# EAGLE design control (EAGLE 7.7.0)
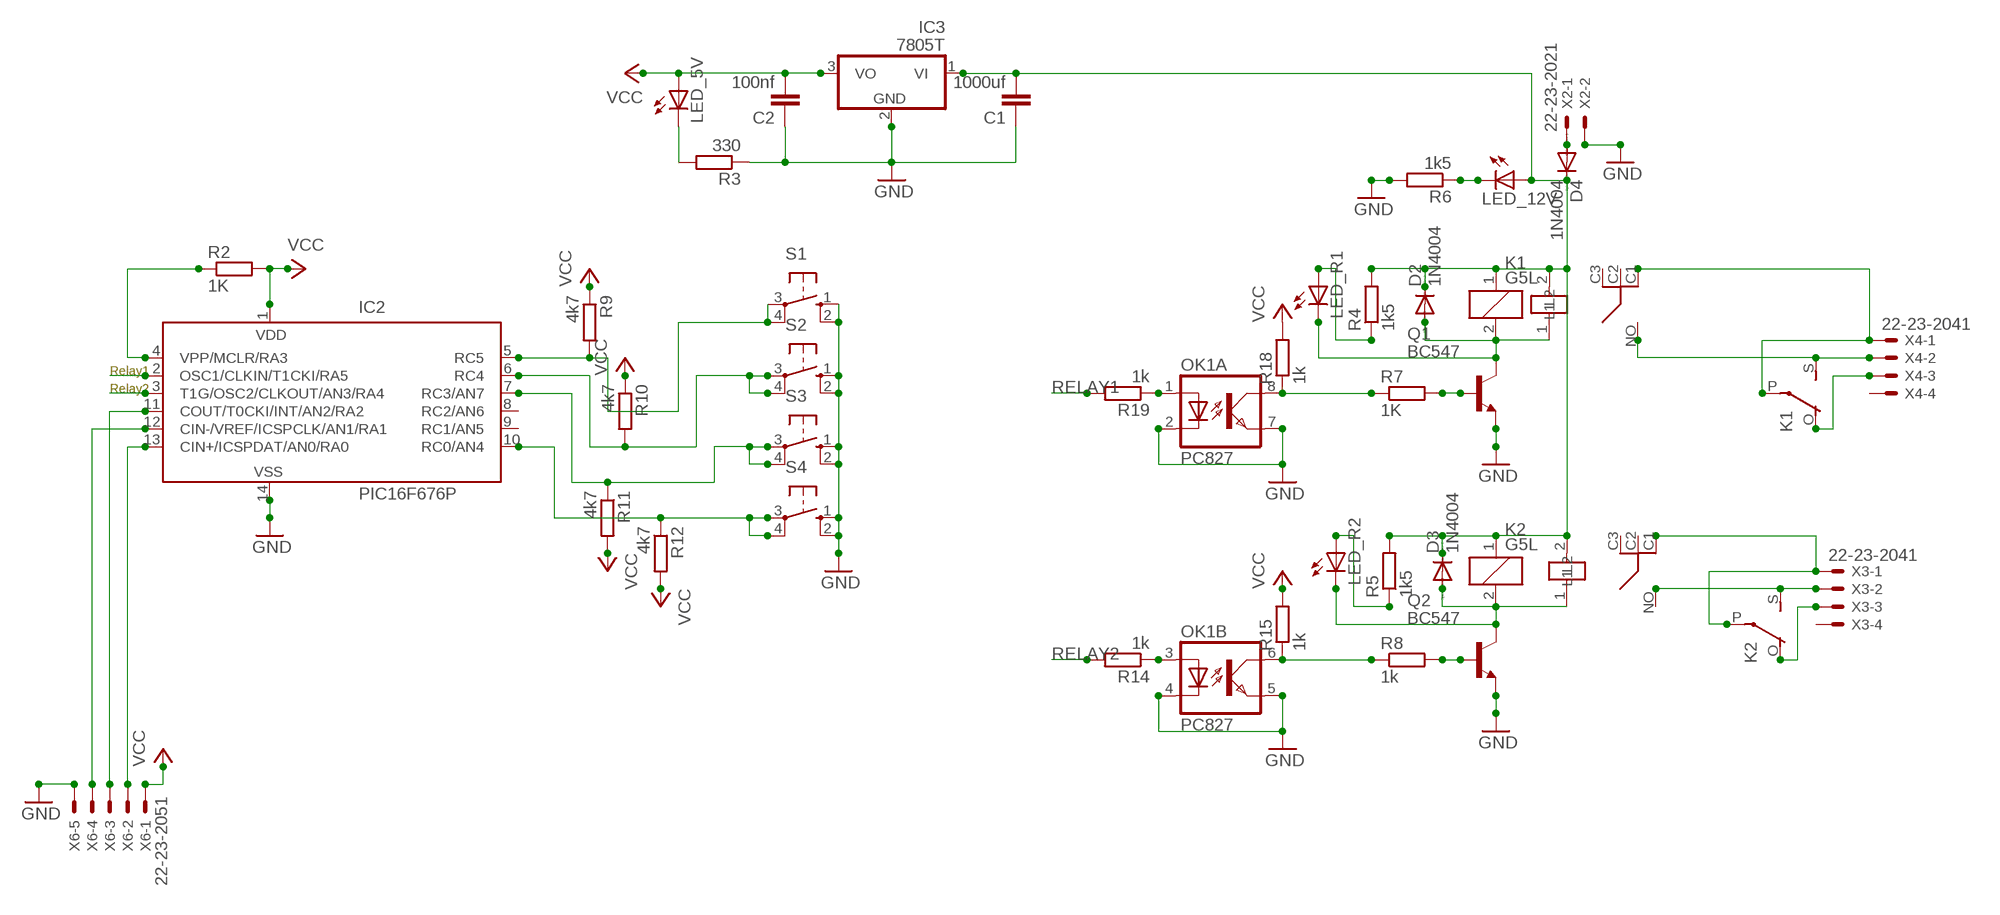
[diagram p0: schematic, sheet 1]

## Parts
C1  1000uf  C5/2.5  [C5B2.5]
C2  100nf  C2.5/6  [C2.5-6]
D2  1N4004  [DO41-10]
D3  1N4004  [DO41-10]
D4  1N4004  [DO41-10]
IC2  PIC16F676P  [DIL14]
IC3  7805T  [TO220H]
K1  G5L  [G5LE]
K2  G5L  [G5LE]
LED_5V  LED3MM  [LED3MM]
LED_12V  LED3MM  [LED3MM]
LED_R1  LED3MM  [LED3MM]
LED_R2  LED3MM  [LED3MM]
OK1  PC827  [DIL08]
Q1  BC547  BC548  [TO92-EBC]
Q2  BC547  BC548  [TO92-EBC]
R2  1K  R-EU_0207/10  [0207/10]
R3  330  R-EU_0207/10  [0207/10]
R4  1k5  R-EU_0207/10  [0207/10]
R5  1k5  R-EU_0207/10  [0207/10]
R6  1k5  R-EU_0207/10  [0207/10]
R7  1K  R-EU_0207/10  [0207/10]
R8  1k  R-EU_0207/10  [0207/10]
R9  4k7  R-EU_0207/10  [0207/10]
R10  4k7  R-EU_0207/10  [0207/10]
R11  4k7  R-EU_0207/10  [0207/10]
R12  4k7  R-EU_0207/10  [0207/10]
R14  1k  R-EU_0207/10  [0207/10]
R15  1k  R-EU_0207/10  [0207/10]
R18  1k  R-EU_0207/10  [0207/10]
R19  1k  R-EU_0207/10  [0207/10]
S1  40-XX  [B3F-40XX]
S2  40-XX  [B3F-40XX]
S3  40-XX  [B3F-40XX]
S4  40-XX  [B3F-40XX]
U$1  RL703  [RL703]
U$2  RL703  [RL703]
X2  22-23-2021  [22-23-2021]
X3  22-23-2041  [22-23-2041]
X4  22-23-2041  [22-23-2041]
X6  22-23-2051  [22-23-2051]

## Nets
GND: C1.1 C2.1 IC2.14(VSS) IC3.2(GND) OK1.2(A:C) OK1.4(B:C) OK1.5(B:EMIT) OK1.7(A:EMIT) Q1.E Q2.E R3.1 R6.2 S1.1(S) S1.2(S1) S2.1(S) S2.2(S1) S3.1(S) S3.2(S1) S4.1(S) S4.2(S1) X2.2 X6.5
N$6: IC2.11(COUT/T0CKI/INT/AN2/RA2) X6.3
N$7: IC2.13(CIN+/ICSPDAT/AN0/RA0) X6.2
N$8: IC2.12(CIN-/VREF/ICSPCLK/AN1/RA1) X6.4
N$9: IC2.4(VPP/MCLR/RA3) R2.1
N$10: Q1.B R7.2
N$11: D2.A K1.2 LED_R1.K(C) Q1.C U$1.1(L2)
N$12: D3.A K2.2 LED_R2.K(C) Q2.C U$2.1(L2)
N$13: Q2.B R8.2
N$15: K2.P(2:P) U$2.C1 X3.1
N$16: K2.S(2:S) X3.2
N$17: K2.O(2:O) X3.3
N$18: K1.S(2:S) U$1.NO X4.2
N$19: K1.P(2:P) U$1.C1 X4.1
N$20: K1.O(2:O) X4.3
N$21: D4.A X2.1
N$22: LED_5V.K(C) R3.2
N$23: LED_R2.A R5.1
N$25: IC2.6(RC4) R10.2 S2.3(P) S2.4(P1)
N$26: LED_R1.A R4.1
N$27: IC2.7(RC3/AN7) R11.1 S3.3(P) S3.4(P1)
N$28: IC2.10(RC0/AN4) R12.1 S4.3(P) S4.4(P1)
N$30: LED_12V.K(C) R6.1
N$34: IC2.5(RC5) R9.2 S1.3(P) S1.4(P1)
N$37: C1.2 D2.C D3.C D4.C IC3.1(VI) K1.1 K2.1 LED_12V.A R4.2 R5.2 U$1.2(L1) U$2.2(L1)
N$38: OK1.8(A:COL) R7.1 R18.1
N$39: OK1.6(B:COL) R8.1 R15.1
N$40: OK1.3(B:A) R14.1
N$41: OK1.1(A:A) R19.1
RELAY1: IC2.2(OSC1/CLKIN/T1CKI/RA5) R19.2
RELAY2: IC2.3(T1G/OSC2/CLKOUT/AN3/RA4) R14.2
VCC: C2.2 IC2.1(VDD) IC3.3(VO) LED_5V.A R2.2 R9.1 R10.1 R11.2 R12.2 R15.2 R18.2 X6.1
Unconnected: IC2.8(RC2/AN6) IC2.9(RC1/AN5) U$1.C2 U$1.C3 U$2.C2 U$2.C3 U$2.NO X3.4 X4.4

## Notes on the sheet
- Relay1
- Relay2

## Library data of the parts
C1 C2 = capacitor-wima:C: CAPACITOR naming: grid - package width
D2-D4 = diode:1N4004: DIODE general purpose rectifier, 1 A
IC2 = microchip:PIC16F676: 14-Pin, Flash-Based 8-Bit CMOS Microcontroller High Performance RISC CPU: * Only 35 instructions to learn - All single-cycle instructions except branches * Operating speed: - DC - 20 MHz oscillator/clock input - DC - 200 ns instruction cycle * Internal and external oscillator options - Precision Internal 4 MHz oscillator factory calibrated to ±1% - External Oscillator support for crystals and resonators - 5?s wake-up from SLEEP, 3.0V, typical * Power saving SLEEP mode * Wide operating voltage range - 2.0V to 5.5V * Industrial and Extended temperature range * Low power Power-on Reset (POR) * Power-up Timer (PWRT) and Oscillator Start-up Timer (OST) * Brown-out Detect (BOD) * Watchdog Timer (WDT) with independent oscillator for reliable operation * Multiplexed MCLR/Input-pin * Interrupt-on-pin change * Individual programmable weak pull-ups * Programmable code protection * High Endurance FLASH/EEPROM Cell - 100,000 write FLASH endurance - 1,000,000 write EEPROM endurance - FLASH/Data EEPROM Retention: > 40 years * Standby Current: - 1 nA @ 2.0V, typical * Operating Current: - 8.5?A @ 32 kHz, 2.0V, typical - 100?A @ 1 MHz, 2.0V, typical * Watchdog Timer Current - 300 nA @ 2.0V, typical * Timer1 oscillator current: - 4?A @ 32 kHz, 2.0V, typical * 12 I/O pins with individual direction control * High current sink/source for direct LED drive * Analog-to-Digital Converter module (PIC16F676): - 10-bit resolution - Programmable 8-channel input - Voltage reference input * In-Circuit Serial ProgrammingTM (ICSPTM) via two pins Source: http://ww1.microchip.com/downloads/en/DeviceDoc/40039E.pdf; MF: MICROCHIP; MPN: PIC16F676-I/P; OC_FARNELL: 9760512; OC_NEWARK: 54K2829
IC3 = linear:78*: Positive VOLTAGE REGULATOR Source: http://cache.national.com/ds/LM/LM78L05.pdf http://www.fairchildsemi.com/ds/LM/LM7805.pdf
K1 K2 = relay:G5L: RELAY 1 x switch, 10 A/120 V AC, 8 A/30 V ADC, Omron; OC_FARNELL: unknown; OC_NEWARK: unknown
LED_5V LED_12V LED_R1 LED_R2 = led:LED: LED OSRAM: - CHIPLED LG R971, LG N971, LY N971, LG Q971, LY Q971, LO R971, LY R971 LH N974, LH R974 LS Q976, LO Q976, LY Q976 LO Q996 - Hyper CHIPLED LW Q18S LB Q993, LB Q99A, LB R99A - SideLED LS A670, LO A670, LY A670, LG A670, LP A670 LB A673, LV A673, LT A673, LW A673 LH A674 LY A675 LS A676, LA A676, LO A676, LY A676, LW A676 LS A679, LY A679, LG A679 - Hyper Micro SIDELED® LS Y876, LA Y876, LO Y876, LY Y876 LT Y87S - SmartLED LW L88C, LW L88S LB L89C, LB L89S, LG L890 LS L89K, LO L89K, LY L89K LS L896, LA L896, LO L896, LY L896 - TOPLED LS T670, LO T670, LY T670, LG T670, LP T670 LSG T670, LSP T670, LSY T670, LOP T670, LYG T670 LG T671, LOG T671, LSG T671 LB T673, LV T673, LT T673, LW T673 LH T674 LS T676, LA T676, LO T676, LY T676, LB T676, LH T676, LSB T676, LW T676 LB T67C, LV T67C, LT T67C, LS T67K, LO T67K, LY T67K, LW E67C LS E67B, LA E67B, LO E67B, LY E67B, LB E67C, LV E67C, LT E67C LW T67C LS T679, LY T679, LG T679 LS T770, LO T770, LY T770, LG T770, LP T770 LB T773, LV T773, LT T773, LW T773 LH T774 LS E675, LA E675, LY E675, LS T675 LS T776, LA T776, LO T776, LY T776, LB T776 LHGB T686 LT T68C, LB T68C - Hyper Mini TOPLED® LB M676 - Mini TOPLED Santana® LG M470 LS M47K, LO M47K, LY M47K Source: http://www.osram.convergy.de LUXEON: - LUMILED® LXK2-PW12-R00, LXK2-PW12-S00, LXK2-PW14-U00, LXK2-PW14-V00 LXK2-PM12-R00, LXK2-PM12-S00, LXK2-PM14-U00 LXK2-PE12-Q00, LXK2-PE12-R00, LXK2-PE12-S00, LXK2-PE14-T00, LXK2-PE14-U00 LXK2-PB12-K00, LXK2-PB12-L00, LXK2-PB12-M00, LXK2-PB14-N00, LXK2-PB14-P00, LXK2-PB14-Q00 LXK2-PR12-L00, LXK2-PR12-M00, LXK2-PR14-Q00, LXK2-PR14-R00 LXK2-PD12-Q00, LXK2-PD12-R00, LXK2-PD12-S00 LXK2-PH12-R00, LXK2-PH12-S00 LXK2-PL12-P00, LXK2-PL12-Q00, LXK2-PL12-R00 Source: www.luxeon.com KINGBRIGHT: KA-3528ASYC Source: www.kingbright.com
OK1 = optocoupler:PC827: SHARP OPTO COUPLER; OC_FARNELL: unknown; OC_NEWARK: unknown
Q1 Q2 = transistor-npn:BC548*: NPN Transistor
R2-R12 R14 R15 R18 R19 = resistor:R-EU_: RESISTOR, European symbol
S1-S4 = switch-omron:40-XX: OMRON SWITCH; MF: OMRON COMPONENTS USA; MPN: B3F-4000; OC_FARNELL: 176434; OC_NEWARK: 36K3105
U$1 U$2 = relay:RL703
X2 = con-molex:22-23-2021: .100" (2.54mm) Center Header - 2 Pin; MF: MOLEX; MPN: 22-23-2021; OC_FARNELL: 1462926; OC_NEWARK: 25C3832
X3 X4 = con-molex:22-23-2041: .100" (2.54mm) Center Header - 4 Pin; MF: MOLEX; MPN: 22-23-2041; OC_FARNELL: 1462920; OC_NEWARK: 38C0355
X6 = con-molex:22-23-2051: .100" (2.54mm) Center Header - 5 Pin; MF: MOLEX; MPN: 22-23-2051; OC_FARNELL: 1462952; OC_NEWARK: 38C9178

## Board
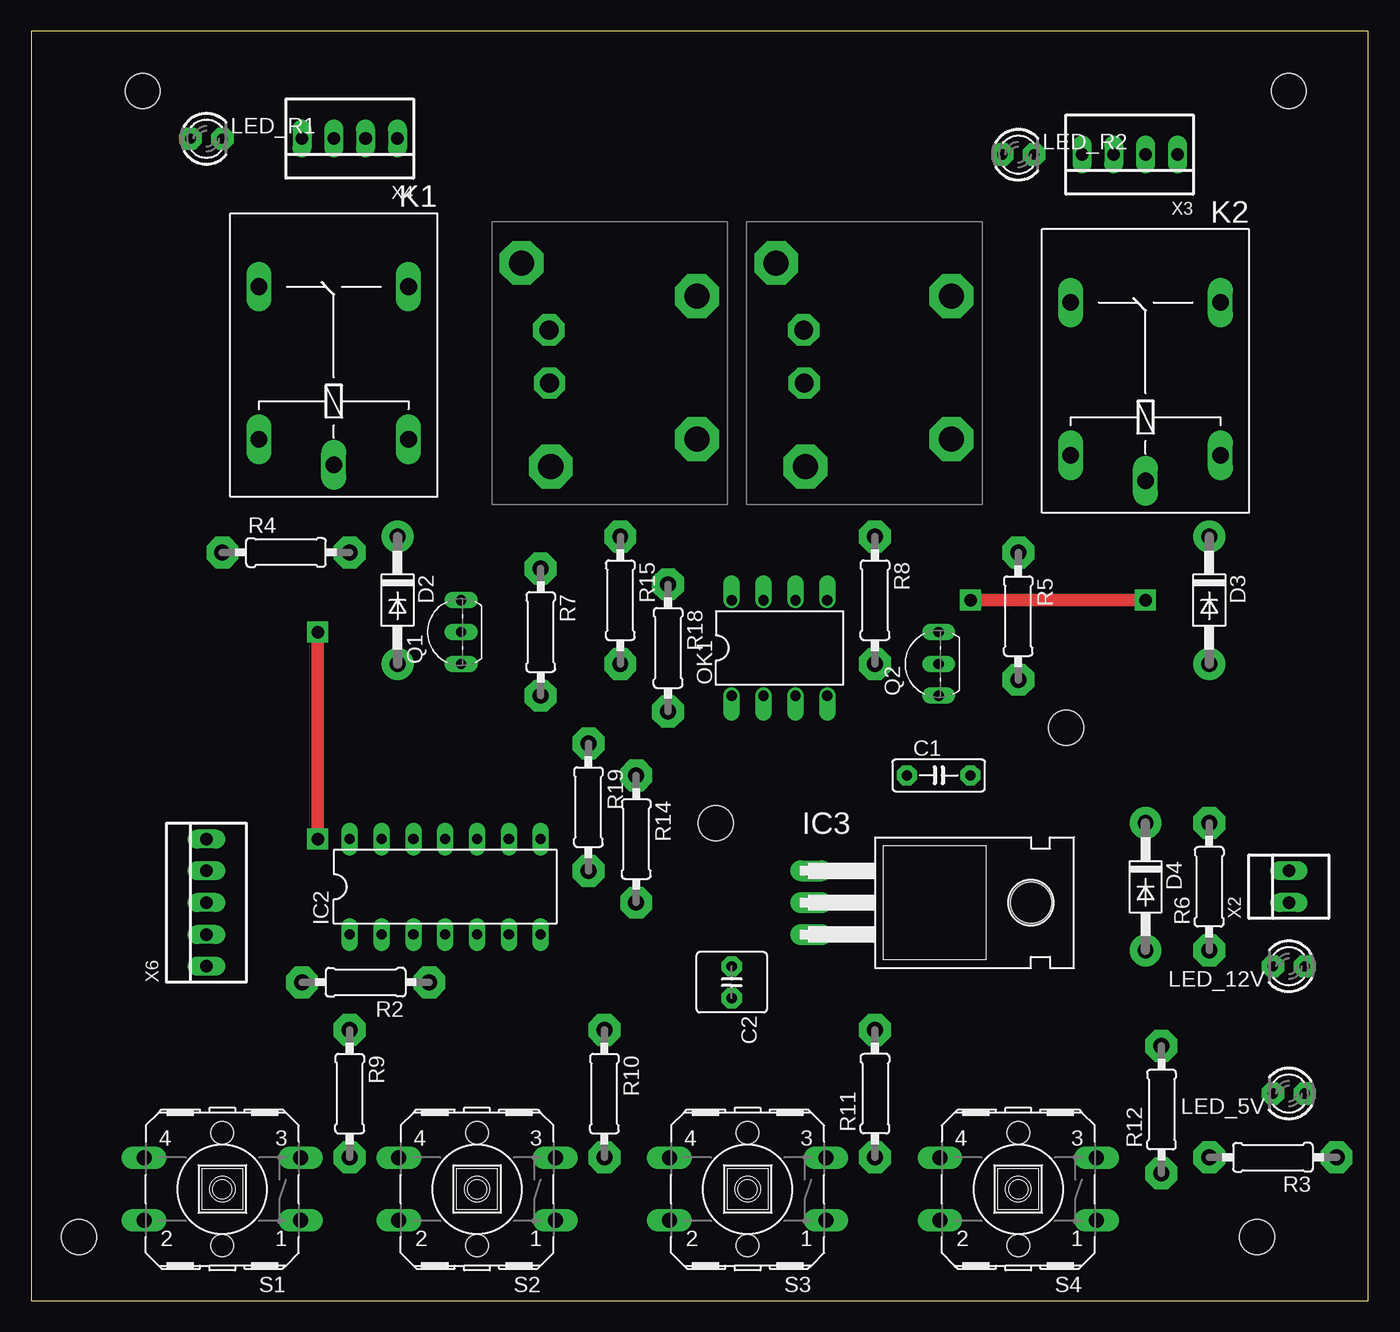
[diagram p1: board, top side]
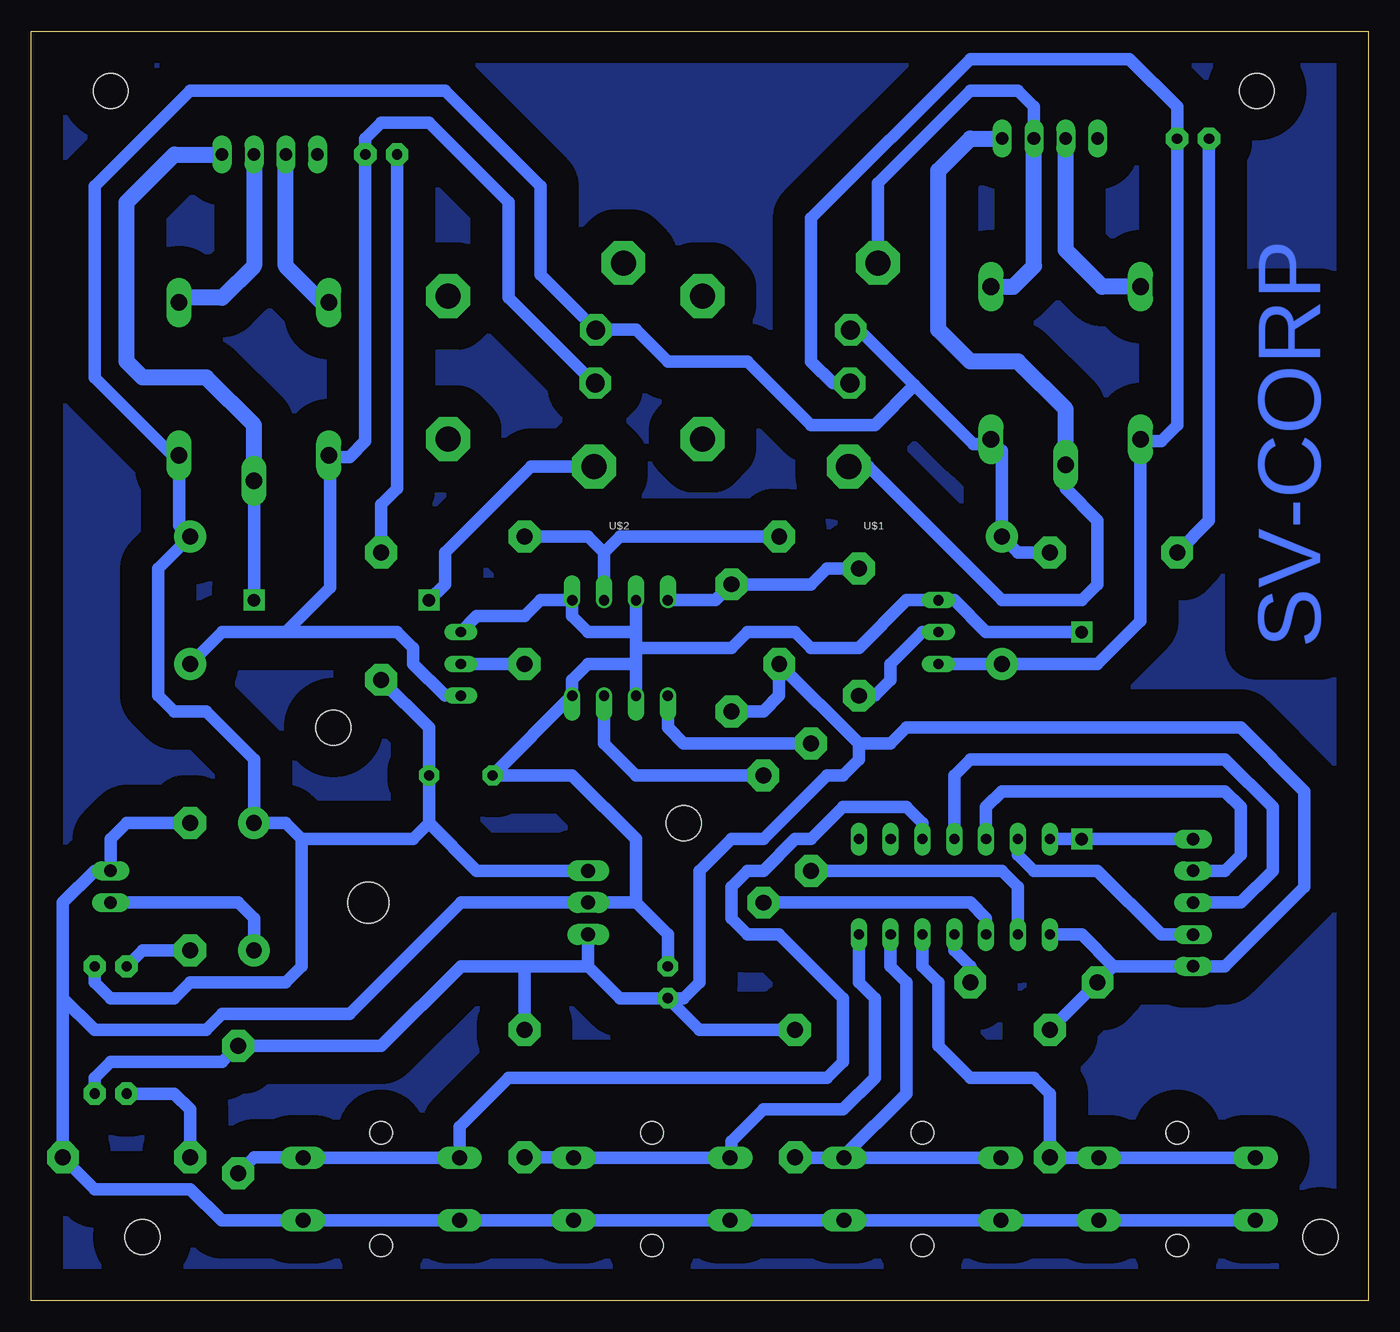
[diagram p2: board, bottom side, seen from below]

Size 106.66 x 101.27 mm. Coordinates in mm from the lower left corner, seen from the top.
Outline: 0,0 106.66,0 106.66,101.27 0,101.27 0,0
Copper layers (1*16): Top 0.035mm / dielectric 1.5mm / Bottom 0.035mm
Design rules "default": minimum track width 10mil, minimum drill 24mil, track to track 8mil, track to pad 8mil, pad to pad 8mil, via to via 8mil, smd to smd 8mil, copper to edge 40mil, drill to drill 8mil, minimum pad ring 10mil, minimum via ring 8mil, stop-mask expansion 4mil, vias tented up to drill 0mil, thermal gap 10mil
Holes 2.8 mm at 3.81,5.08 97.79,5.08 8.89,96.52 100.33,96.52 54.61,38.1 82.55,45.72

### Footprints (pad centres in the part's own frame; a part is rotated, then mirrored left to right if it is on the bottom)
C5B2.5 = drill 0.813 pad 1.6 octagon: 1 -2.54,0; 2 2.54,0
C2.5-6 = drill 0.813 pad 1.6 octagon: 1 -1.27,0; 2 1.27,0
DO41-10 = drill 1.27 pad 2.54: A 5.08,0; C -5.08,0
DIL14 = drill 0.813 long: 1 -7.62,-3.81; 2 -5.08,-3.81; 3 -2.54,-3.81; 4 0,-3.81; 5 2.54,-3.81; 6 5.08,-3.81; 7 7.62,-3.81; 8 7.62,3.81; 9 5.08,3.81; 10 2.54,3.81; 11 0,3.81; 12 -2.54,3.81; 13 -5.08,3.81; 14 -7.62,3.81
TO220H = drill 1.118 long: 1 -2.54,-10.16; 2 0,-10.16; 3 2.54,-10.16 | hole 3.302: 0,7.366
G5LE = drill 1.321 long: 1 -7.493,-5.969; 2 -7.493,5.969; O 4.699,5.969; P -9.525,0; S 4.699,-5.969
LED3MM = drill 0.813 pad 1.778 octagon: A -1.27,0; K 1.27,0
DIL08 = drill 0.813 offset: 1 -3.81,-3.81; 2 -1.27,-3.81; 3 1.27,-3.81; 4 3.81,-3.81; 5 3.81,3.81; 6 1.27,3.81; 7 -1.27,3.81; 8 -3.81,3.81
TO92-EBC = drill 0.813 long: B 0,-1.27; C -2.54,-1.27; E 2.54,-1.27
0207/10 = drill 1.27 pad 2.54 octagon: 1 -5.08,0; 2 5.08,0
B3F-40XX = drill 1.194 long: 1 -6.248,2.489; 2 6.248,2.489; 3 -6.248,-2.489; 4 6.248,-2.489 | hole 1.803: 0,-4.496; 0,4.496
RL703 = drill 1.5 pad 2.5 octagon: 1 1.73,-5.643; 2 -2.51,-5.693 | drill 2 pad 3.5 octagon: C1 8.38,-5.543; C2 6.2,6.107; C3 -5.21,6.107; NO -7.86,-7.883
22-23-2021 = drill 1 long: 1 -1.27,0; 2 1.27,0
22-23-2041 = drill 1 long: 1 -3.81,0; 2 -1.27,0; 3 1.27,0; 4 3.81,0
22-23-2051 = drill 1 long: 1 -5.08,0; 2 -2.54,0; 3 0,0; 4 2.54,0; 5 5.08,0

### Placement (x,y rotation side)
C1  72.39,41.91 0 top
C2  55.88,25.4 270 top
D2  29.21,55.88 270 top
D3  93.98,55.88 270 top
D4  88.9,33.02 270 top
IC2  33.02,33.02 0 top
IC3  72.39,31.75 270 top
K1  24.13,76.2 90 top
K2  88.9,74.93 90 top
LED_5V  100.33,16.51 180 top
LED_12V  100.33,26.67 180 top
LED_R1  13.97,92.71 0 top
LED_R2  78.74,91.44 0 top
OK1  59.69,52.07 0 top
Q1  33.02,53.34 90 top
Q2  71.12,50.8 90 top
R2  26.67,25.4 180 top
R3  99.06,11.43 180 top
R4  20.32,59.69 0 top
R5  78.74,54.61 270 top
R6  93.98,33.02 90 top
R7  40.64,53.34 270 top
R8  67.31,55.88 270 top
R9  25.4,16.51 270 top
R10  45.72,16.51 270 top
R11  67.31,16.51 90 top
R12  90.17,15.24 90 top
R14  48.26,36.83 270 top
R15  46.99,55.88 270 top
R18  50.8,52.07 270 top
R19  44.45,39.37 270 top
S1  15.24,8.89 180 top
S2  35.56,8.89 180 top
S3  57.15,8.89 180 top
S4  78.74,8.89 180 top
U$1  46.99,74.93 270 top
U$2  67.31,74.93 270 top
X2  100.33,33.02 90 top
X3  87.63,91.44 180 top
X4  25.4,92.71 180 top
X6  13.97,31.75 90 top

### Tracks (layer width: path | path; a pad name or v marks a point on that pad's centre or on a via)
GND  (via drill 1 pad 1.68)
  Top 1.016: v22.86,53.34 v22.86,36.83
  Bottom 1.016: R6.2 99.06,38.1 100.33,36.83 X2.2 101.6,34.29 104.14,31.75 104.14,24.13 | S2.2 S2.1 S3.2 S3.1 | S2.2 30.53,6.4 30.48,6.35 30.53,6.35 S2.2 | S2.2 S1.1 S1.2 | S3.1 63.45,6.4 63.5,6.35 63.45,6.35 S3.1 | S3.1 S4.2 S4.1 | S4.1 86.31,6.4 86.36,6.35 85.04,6.35 S4.1 | IC2.14 v22.86,36.83 X6.5 | OK1.7 58.42,53.34 | 58.42,53.34 58.42,52.07 | 58.42,52.07 58.42,50.8 | 58.42,50.8 OK1.2 | 58.42,50.8 62.23,50.8 63.5,49.53 OK1.4 C1.1 63.5,41.91 58.42,36.83 58.42,31.75 | 58.42,53.34 62.23,53.34 63.5,54.61 OK1.5 66.04,55.88 67.31,54.61 71.12,54.61 Q2.E | 58.42,52.07 50.8,52.07 49.53,53.34 45.72,53.34 44.45,52.07 40.64,52.07 36.83,55.88 Q1.E 33.02,55.88 30.48,53.34 v22.86,53.34 | 58.42,31.75 IC3.2 72.39,31.75 81.28,22.86 91.44,22.86 92.71,21.59 101.6,21.59 104.14,24.13 | 104.14,24.13 R3.1 101.6,8.89 93.98,8.89 91.49,6.4 S4.1 | C2.1 55.88,29.21 58.42,31.75
N$1
  pour Bottom (isolate 2.54): -1.27,101.6 107.95,101.6 107.95,-1.27 -1.27,-1.27
N$6
  Bottom 1.016: IC2.11 33.02,41.91 31.75,43.18 11.43,43.18 7.62,39.37 7.62,34.29 10.16,31.75 X6.3
N$7
  Bottom 1.016: X6.2 16.51,29.21 21.59,34.29 26.67,34.29 27.94,35.56 IC2.13
N$8
  Bottom 1.016: X6.4 11.43,34.29 10.16,35.56 10.16,39.37 11.43,40.64 29.21,40.64 30.48,39.37 IC2.12
N$9
  Bottom 1.016: IC2.4 33.02,27.94 31.75,26.67 R2.1
N$10
  Bottom 1.016: Q1.B 35.56,53.34 38.1,50.8 38.1,49.53 39.37,48.26 R7.2
N$11
  Bottom 1.016: U$1.1 42.72,73.2 44.45,74.93 44.45,86.36 31.75,99.06 19.05,99.06 15.24,95.25 LED_R1.K 15.24,69.85 16.51,68.58 18.03,68.58 K1.2 18.16,54.23 21.59,50.8 D2.A Q1.C
N$12
  Bottom 1.016: 82.8,67.31 81.28,67.31 80.01,68.58 LED_R2.K 80.01,92.71 78.74,93.98 74.93,93.98 68.58,87.63 68.58,80.01 61.77,73.2 U$2.1 | 82.8,67.31 K2.2 | 86.36,53.34 77.47,53.34 76.2,52.07 76.2,50.8 73.66,48.26 Q2.C | 82.8,67.31 82.8,56.9 86.36,53.34 | 86.36,53.34 91.44,53.34 D3.A
N$13
  Bottom 1.016: R8.2 Q2.B
N$15  (via drill 1 pad 1.68)
  Top 1.016: v74.93,55.88 v88.9,55.88
  Bottom 1.016: K2.P v88.9,55.88 | U$2.C1 66.8,66.55 73.66,59.69 73.66,57.15 v74.93,55.88
  Bottom 1.27: K2.P 88.9,69.85 92.71,73.66 97.79,73.66 99.06,74.93 99.06,87.63 95.25,91.44 X3.1
N$16
  Bottom 1.27: X3.2 88.9,82.55 91.44,80.01 94.49,80.01 K2.S
N$17
  Bottom 1.27: K2.O 83.44,79.63 86.36,82.55 X3.3
N$18
  Bottom 1.016: U$1.NO 39.11,89.16 31.75,96.52 27.94,96.52 26.67,95.25 X4.2
  Bottom 1.27: K1.S 28.32,80.9 26.67,82.55 X4.2
N$19
  Bottom 1.016: U$1.C1 39.88,66.55 29.21,55.88 22.86,55.88 21.59,57.15 21.59,62.23 24.13,64.77 K1.P
  Bottom 1.27: K1.P 24.13,71.12 27.94,74.93 31.75,74.93 34.29,77.47 34.29,90.17 31.75,92.71 X4.1
N$20
  Bottom 1.27: X4.3 24.13,83.82 21.21,80.9 K1.O
N$21
  Bottom 1.016: X2.1 90.17,31.75 88.9,30.48 D4.A
N$22
  Bottom 1.016: R3.2 93.98,15.24 95.25,16.51 LED_5V.K
N$23
  Bottom 1.016: R5.1 78.74,63.5 77.47,64.77 LED_R2.A
N$25
  Bottom 1.016: S2.3 S2.4 30.53,11.43 30.48,11.43 | S2.3 45.67,11.38 R10.2 | IC2.6 38.1,26.67 36.83,25.4 36.83,16.51 41.81,11.53 S2.3
N$26
  Bottom 1.016: LED_R1.A 12.7,62.23 R4.1
N$27
  Bottom 1.016: R11.1 63.45,11.43 S3.3 S3.4 50.8,11.48 50.8,12.7 48.26,15.24 41.91,15.24 39.37,17.78 39.37,24.13 40.64,25.4 IC2.7
N$28
  Bottom 1.016: R12.1 88.9,11.43 85.04,11.43 S4.3 S4.4 72.49,13.87 68.58,17.78 43.18,17.78 41.91,19.05 41.91,24.13 46.99,29.21 49.53,29.21 50.8,30.48 50.8,33.02 49.53,34.29 48.26,34.29 45.72,36.83 44.45,36.83 41.91,39.37 36.83,39.37 35.56,38.1 IC2.10
N$30
  Bottom 1.016: LED_12V.K 97.79,27.94 R6.1
N$34
  Bottom 1.016: S1.4 S1.3 25.35,11.38 R9.2 25.4,16.51 26.67,17.78 31.75,17.78 34.29,20.32 34.29,25.4 35.56,26.67 IC2.5
N$37
  Bottom 1.016: 85.09,36.83 86.36,38.1 D4.C 88.9,43.18 92.71,46.99 95.25,46.99 96.52,48.26 96.52,58.42 D3.C 94.87,61.85 K2.1 95.38,67.44 101.6,73.66 101.6,88.9 93.98,96.52 73.66,96.52 66.04,88.9 66.04,81.86 U$2.2 61.59,77.47 58.42,77.47 55.88,74.93 49.53,74.93 44.45,69.85 39.37,69.85 36.2,73.02 | 85.09,36.83 85.09,26.67 86.36,25.4 93.98,25.4 95.25,24.13 100.33,24.13 101.6,25.4 LED_12V.A | IC3.1 71.12,34.29 74.93,38.1 | 74.93,38.1 C1.2 74.93,45.72 R5.2 | 85.09,36.83 76.2,36.83 74.93,38.1 | 36.2,73.02 31.5,68.33 30.48,68.33 K1.1 29.21,67.82 D2.C 27.94,59.69 R4.2 | 36.2,73.02 40.64,77.47 41.27,77.47 U$1.2
N$38
  Bottom 1.016: OK1.8 52.07,55.88 R18.1 44.45,57.15 43.18,58.42 R7.1
N$39
  Bottom 1.016: OK1.6 60.96,59.69 | 60.96,59.69 59.69,60.96 R15.1 | R8.1 62.23,60.96 60.96,59.69
N$40
  Bottom 1.016: R14.1 58.42,41.91 60.96,44.45 OK1.3
N$41
  Bottom 1.016: R19.1 54.61,44.45 55.88,45.72 OK1.1
RELAY1
  Bottom 1.016: IC2.2 27.94,33.02 29.21,34.29 R19.2
RELAY2
  Bottom 1.016: IC2.3 30.48,30.48 31.75,31.75 R14.2
VCC
  Bottom 1.016: IC3.3 62.23,26.67 | 67.31,26.67 62.23,26.67 | R11.2 67.31,26.67 | R18.2 48.26,46.99 46.99,48.26 R15.2 40.64,44.45 | 20.32,26.67 R2.2 R9.1 | IC2.1 22.86,29.21 20.32,26.67 | 67.31,26.67 72.39,26.67 78.74,20.32 R12.2 91.44,19.05 100.33,19.05 101.6,17.78 LED_5V.A | 20.32,26.67 X6.1 11.43,26.67 5.08,33.02 5.08,40.64 10.16,45.72 36.83,45.72 38.1,44.45 40.64,44.45 | R10.1 53.34,21.59 C2.2 | C2.2 59.69,24.13 62.23,26.67 | 40.64,44.45 40.64,43.18 41.91,41.91 43.18,41.91 48.26,36.83 50.8,36.83 53.34,34.29 53.34,25.4 54.61,24.13 C2.2

### Text on the board
Bottom: SV-CORP